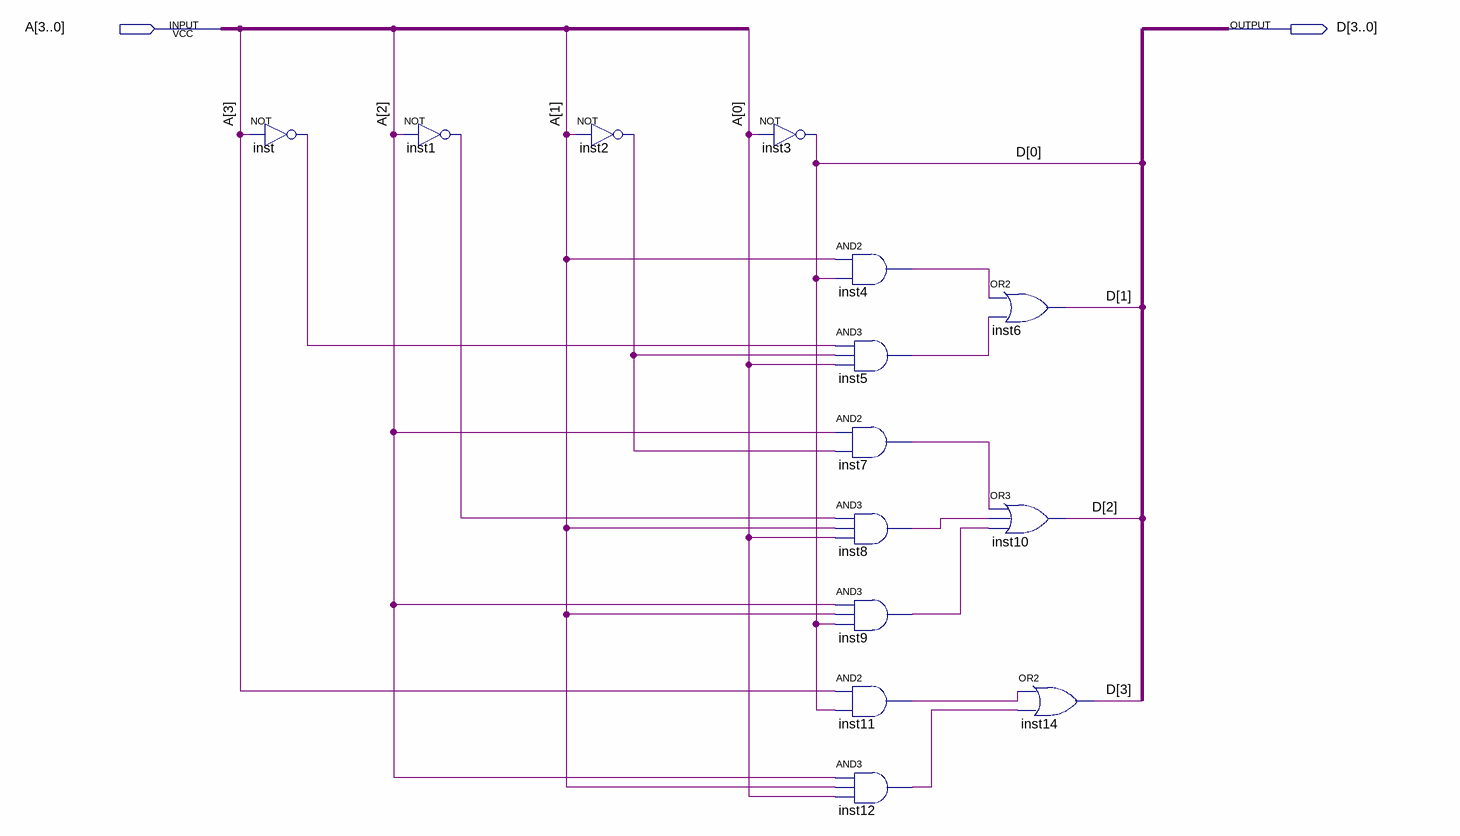
[diagram p0: schematic sheet]
// Quartus schematic countercombinationlogic.bdf as structural Verilog: 14 symbols, 2 pins
module countercombinationlogic (
  input  [3:0] A,
  output [3:0] D
);

  wire inst1_out, inst2_out, inst4_out, inst5_out, inst7_out, inst8_out, inst9_out, inst11_out, inst12_out,
       inst_out;

  not inst (inst_out, A[3]);
  not inst1 (inst1_out, A[2]);
  not inst2 (inst2_out, A[1]);
  not inst3 (D[0], A[0]);
  and inst4 (inst4_out, A[1], D[0]);
  and inst5 (inst5_out, inst_out, inst2_out, A[0]);
  and inst7 (inst7_out, A[2], inst2_out);
  and inst8 (inst8_out, inst1_out, A[1], A[0]);
  and inst9 (inst9_out, A[2], A[1], D[0]);
  and inst11 (inst11_out, A[3], D[0]);
  and inst12 (inst12_out, A[2], A[1], A[0]);
  or inst6 (D[1], inst4_out, inst5_out);
  or inst10 (D[2], inst7_out, inst8_out, inst9_out);
  or inst14 (D[3], inst11_out, inst12_out);
endmodule
